# EAGLE schematic LSM330DLC (EAGLE 6.2)
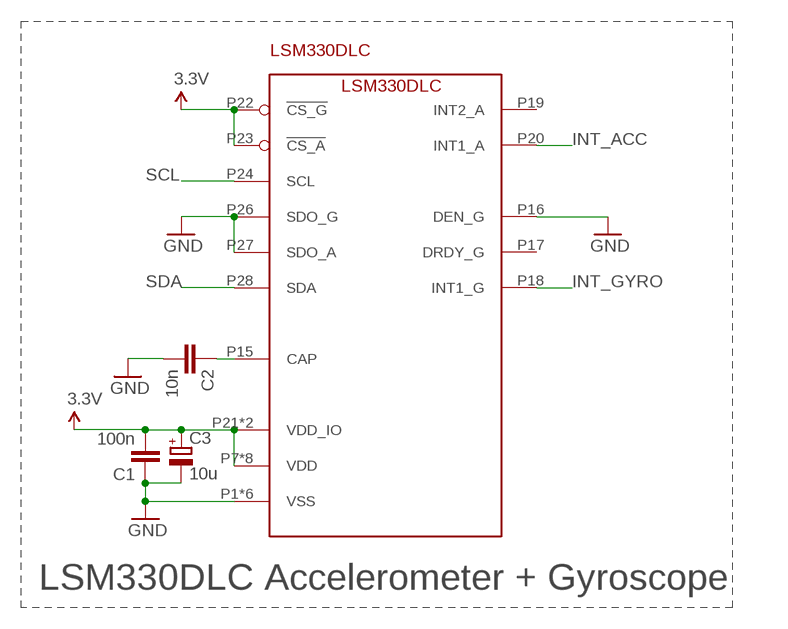
[diagram p0: schematic, sheet 1]

## Parts
C1  100n  C-EUC0805  [C0805]
C2  10n  C-EUC0805  [C0805]
C3  10u  CPOL-EUSMCA  [SMC_A]
LSM330DLC  LSM330DLC  [LGA_4X5X1P1_28L]

## Nets
3.3V: C1.2 C3.+ LSM330DLC.P7(VDD) LSM330DLC.P8(VDD) LSM330DLC.P9(VDD) LSM330DLC.P10(VDD) LSM330DLC.P11(VDD) LSM330DLC.P12(VDD) LSM330DLC.P13(VDD) LSM330DLC.P14(VDD) LSM330DLC.P21(VDD_IO) LSM330DLC.P22(!CS_G) LSM330DLC.P23(!CS_A) LSM330DLC.P25(VDD_IO)
GND: C1.1 C2.2 C3.- LSM330DLC.P1(VSS) LSM330DLC.P2(VSS) LSM330DLC.P3(VSS) LSM330DLC.P4(VSS) LSM330DLC.P5(VSS) LSM330DLC.P6(VSS) LSM330DLC.P16(DEN_G) LSM330DLC.P26(SDO_G) LSM330DLC.P27(SDO_A)
INT_ACC: LSM330DLC.P20(INT1_A)
INT_GYRO: LSM330DLC.P18(INT1_G)
N$1: C2.1 LSM330DLC.P15(CAP)
SCL: LSM330DLC.P24(SCL)
SDA: LSM330DLC.P28(SDA)
Unconnected: LSM330DLC.P17(DRDY_G) LSM330DLC.P19(INT2_A)

## Notes on the sheet
- LSM330DLC Accelerometer + Gyroscope

## Library data of the parts
C1 C2 = resistor:C-EU: CAPACITOR, European symbol
C3 = rcl:CPOL-EU: POLARIZED CAPACITOR, European symbol
LSM330DLC = sensors-akc_zyr:LSM330DLC